# EAGLE design esp07_co2 (EAGLE 7.4.0)
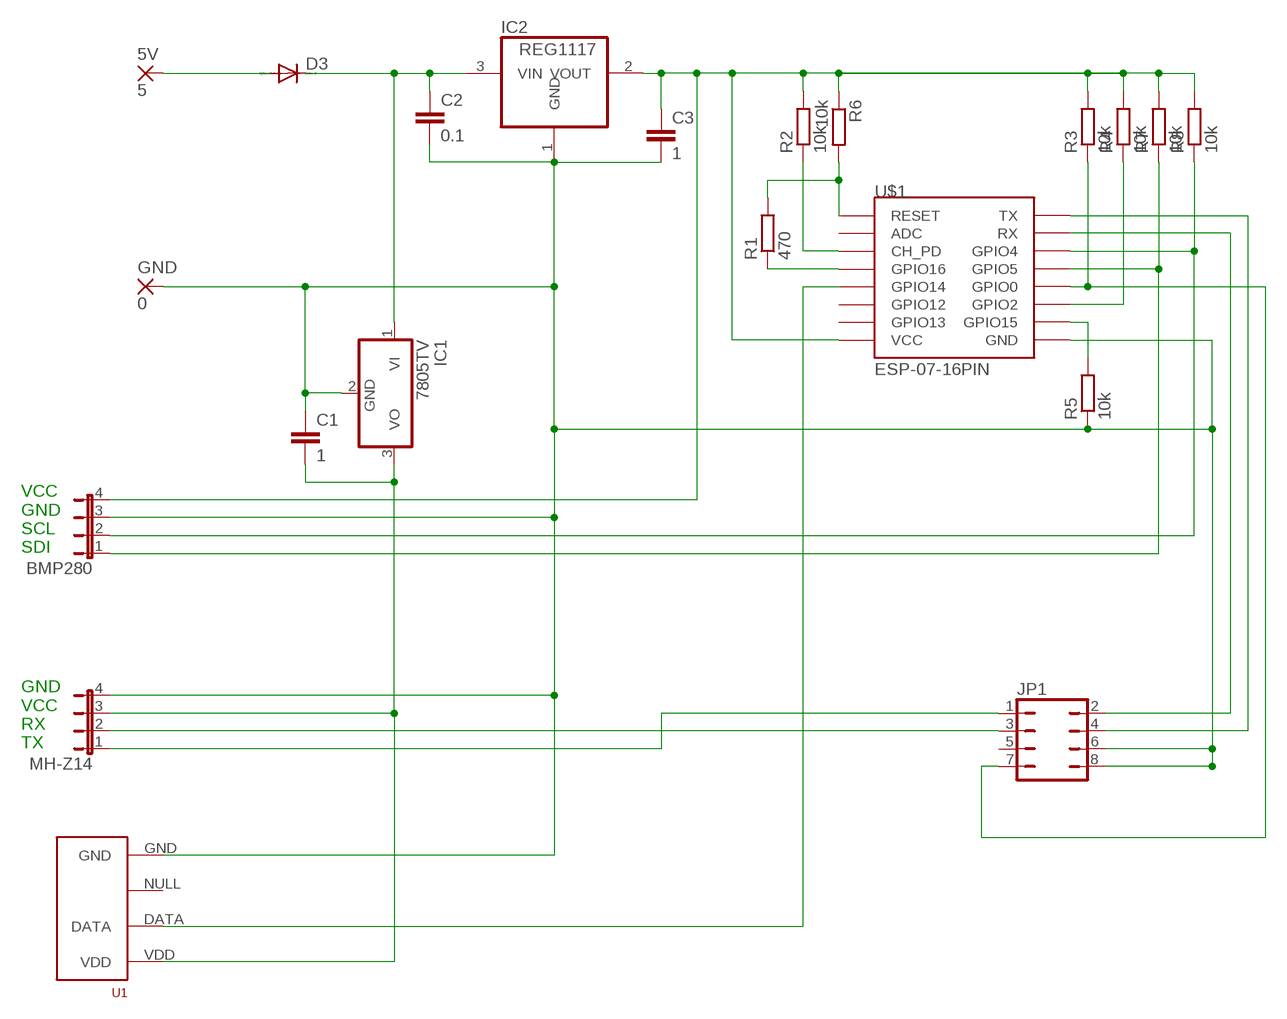
[diagram p0: schematic, sheet 1]

## Parts
5V  5  2,54/0,9  [2,54/0,9]
BMP280  JP4E  [JP4]
C1  1  C-EUC0805  [C0805]
C2  0.1  C-EUC0805  [C0805]
C3  1  C-EUC0805  [C0805]
D3  DIODE-SOD80C  [SOD80C]
GND  0  2,54/0,9  [2,54/0,9]
IC1  7805TV  [TO220V]
IC2  REG1117  [SOT223]
JP1  JP4Q  [JP4Q]
MH-Z14  JP4E  [JP4]
R1  470  R-EU_R1206  [R1206]
R2  10k  R-EU_R1206  [R1206]
R3  10k  R-EU_R1206  [R1206]
R4  10k  R-EU_R1206  [R1206]
R5  10k  R-EU_R1206  [R1206]
R6  10k  R-EU_R1206  [R1206]
R7  10k  R-EU_R1206  [R1206]
R8  10k  R-EU_R1206  [R1206]
U1  RHT03_DHT-22_AM2302RA  [RHT03_DHT-22/RA]
U$1  ESP-07-16PIN  [ESP-07-16PIN]

## Nets
N$1: 5V.1(P) D3.A
N$2: BMP280.2 R8.1 U$1.GPIO4
N$3: BMP280.4 C3.1 IC2.2(VOUT) R2.2 R3.2 R4.2 R6.1 R7.2 R8.2 U$1.VCC
N$4: BMP280.3 C1.1 C2.2 C3.2 GND.1(P) IC1.2(GND) IC2.1(GND) JP1.6 JP1.8 MH-Z14.4 R5.1 U1.GND U$1.GND
N$5: JP1.4 U$1.TX
N$6: JP1.2 U$1.RX
N$7: R1.1 U$1.GPIO16
N$8: R5.2 U$1.GPIO15
N$9: JP1.7 R3.1 U$1.GPIO0
N$10: R4.1 U$1.GPIO2
N$11: R2.1 U$1.CH_PD
N$12: R1.2 R6.2 U$1.REST(RESET)
N$14: JP1.3 MH-Z14.2
N$15: JP1.1 MH-Z14.1
N$16: U1.DATA U$1.GPIO14
N$17: BMP280.1 R7.1 U$1.GPIO5
N$20: C1.2 IC1.3(VO) MH-Z14.3 U1.VDD
N$25: C2.1 D3.C IC1.1(VI) IC2.3(VIN)
Unconnected: JP1.5 U1.NULL U$1.ADC U$1.GPIO12 U$1.GPIO13

## Notes on the sheet
- VCC
  GND
  SCL
  SDI
- GND
  VCC
  RX
  TX

## Library data of the parts
5V GND = wirepad:2,54/0,9: THROUGH-HOLE PAD
BMP280 MH-Z14 = jumper:JP4E: JUMPER
C1-C3 = rcl:C-EU: CAPACITOR, European symbol
D3 = diode:DIODE-: DIODE
IC1 = linear:78*: Positive VOLTAGE REGULATOR Source: http://cache.national.com/ds/LM/LM78L05.pdf http://www.fairchildsemi.com/ds/LM/LM7805.pdf
IC2 = burr-brown:REG1117: 800mA and 1A Low Dropout (LDO) Positive Regulator 1.8V, 2.5V, 2.85V, 3.3V, 5V, and Adj; MPN: REG1117; OC_FARNELL: 1097566; OC_NEWARK: 14P6981
JP1 = jumper:JP4Q: JUMPER
R1-R8 = resistor:R-EU_: RESISTOR, European symbol
U1 = RHT03_DHT-22_AM2302:RHT03_DHT-22_AM2302: RHT03 / DHT-22 / AM2302 Packages and symbol for the RHT03 / DHT-22 relative humidity and temperature sensor. Note: The AM2302 is a wired version of the DHT-22 which typically requires less clearance and is thus provided as a separate package.; PROD_ID: SEN-10167
U$1 = esp8266modules:ESP-07-16PIN: ESP8266 Wifi Module ESP-07 - 16 pins; DIMENSIONS: 22.0 x 16.0 mm; PINS: 16; PITCH: 0.078" / 2 mm

## Board
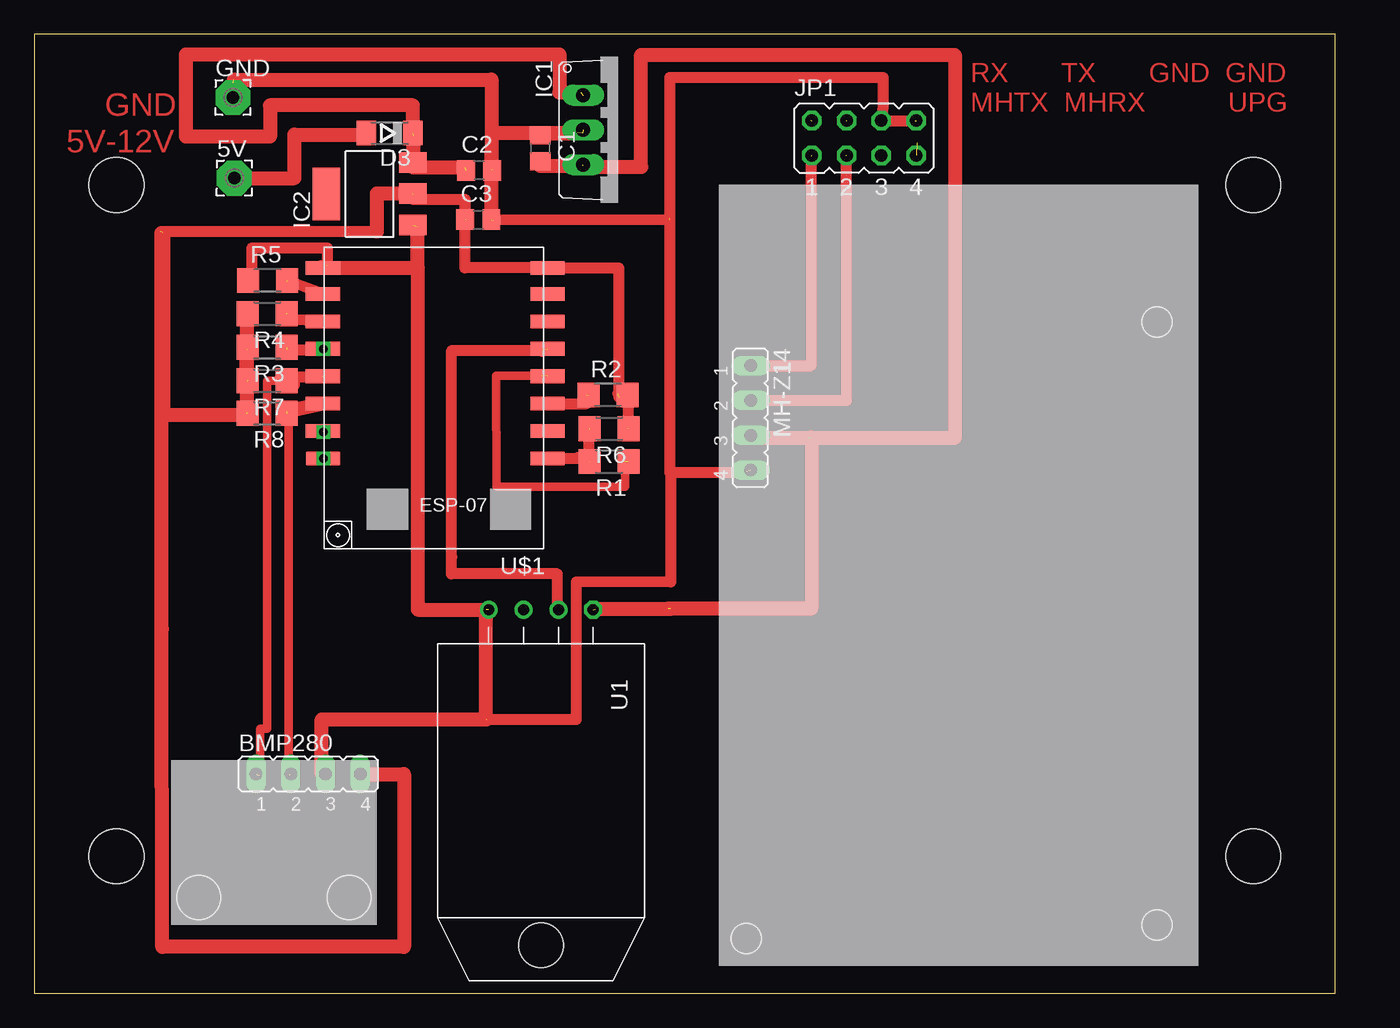
[diagram p1: board, top side]
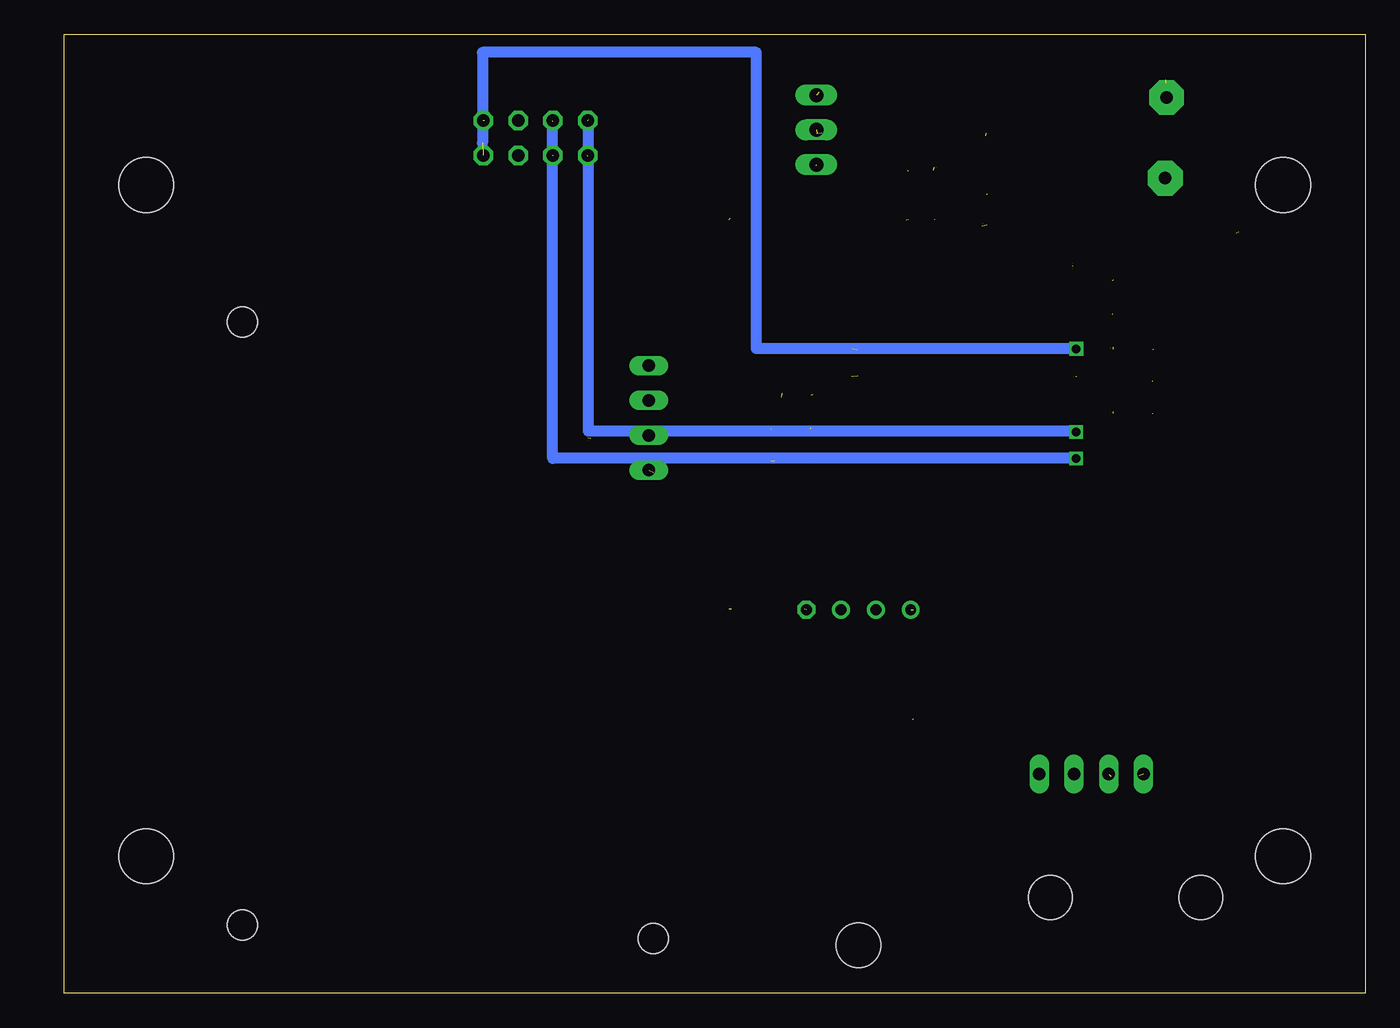
[diagram p2: board, bottom side, seen from below]

Size 95 x 70 mm. Coordinates in mm from the lower left corner, seen from the top.
Outline: 0,0 95,0 95,70 0,70 0,0
Copper layers (1*16): Top 0.035mm / dielectric 1.5mm / Bottom 0.035mm
Design rules "default": minimum track width 10mil, minimum drill 24mil, track to track 8mil, track to pad 8mil, pad to pad 8mil, via to via 8mil, smd to smd 8mil, copper to edge 40mil, drill to drill 8mil, minimum pad ring 10mil, minimum via ring 8mil, stop-mask expansion 4mil, vias tented up to drill 0mil, thermal gap 10mil
Holes 4 mm at 6,59 89,59 89,10 6,10
Holes 2.2 mm at 52,4 82,5 82,49
Holes 3.2 mm at 12,7 23,7

### Footprints (pad centres in the part's own frame; a part is rotated, then mirrored left to right if it is on the bottom)
2,54/0,9 = drill 0.914 pad 2.54 octagon: 1 0,0
JP4 = drill 0.914 long: 1 -3.81,0; 2 -1.27,0; 3 1.27,0; 4 3.81,0
C0805 = smd 1.3 x 1.5: 1 -0.95,0; 2 0.95,0
SOD80C = smd 1.4 x 1.8: A 1.7,0; C -1.7,0
TO220V = drill 1.016 long: 1 -2.54,-2.54; 2 0,-2.54; 3 2.54,-2.54
SOT223 = smd 1.499 x 2.007: 1 -2.261,-3.15; 2 0.025,-3.15; 3 2.311,-3.15 | smd 3.81 x 2.007: 4 0,3.15
JP4Q = drill 0.914 octagon: 1 -3.81,-1.27; 2 -3.81,1.27; 3 -1.27,-1.27; 4 -1.27,1.27; 5 1.27,-1.27; 6 1.27,1.27; 7 3.81,-1.27; 8 3.81,1.27
R1206 = smd 1.6 x 1.803: 1 -1.422,0; 2 1.422,0
RHT03_DHT-22/RA = drill 0.8: DATA -1.27,0; GND 3.81,0; NULL 1.27,0 | drill 0.8 octagon: VDD -3.81,0 | hole 3.25: 0,24.5
ESP-07-16PIN = smd 2.5 x 1: ADC -8.2,3.8; CH_PD -8.2,1.8; GND 8.2,-8.105; GPIO0 8.2,-2.2; GPIO2 8.2,-4.2; GPIO4 8.2,1.8; GPIO5 8.2,-0.2; GPIO12 -8.2,-4.2; GPIO13 -8.2,-6.2; GPIO14 -8.2,-2.2; GPIO15 8.2,-6.2; GPIO16 -8.2,-0.2; REST -8.2,5.8; RX 8.2,3.8; TX 8.2,5.8; VCC -8.2,-8.105

### Placement (x,y rotation side)
5V  14.6,59.5 0 top
BMP280  20,16 0 top
C1  36.95,61.69 270 top
C2  32.47,60.06 0 top
C3  32.42,56.46 0 top
D3  25.95,62.79 180 top
GND  14.51,65.38 0 top
IC1  42.62,63.02 270 top
IC2  24.48,58.34 90 top
JP1  60.59,62.42 0 top
MH-Z14  52.3,42 270 top
R1  41.96,38.82 180 top
R2  41.88,43.67 0 top
R3  17,47.16 180 top
R4  17.02,49.61 180 top
R5  17.04,52.03 0 top
R6  41.98,41.21 180 top
R7  17,44.7 180 top
R8  16.99,42.34 180 top
U1  37,28 180 top
U$1  29.28,44.84 180 top

### Tracks (layer width: path | path; a pad name or v marks a point on that pad's centre or on a via)
N$1
  Top 1.016: 5V.1 19,59.5 19,62.68 24.25,62.68 D3.A
N$2  (2 unrouted)
  Top 0.61: 18.59,42.32 18.59,15.84
  Top 0.813: 18.45,42.46 18.59,42.32
  Top 1.016: U$1.GPIO4 18.45,42.46
N$3  (9 unrouted)
  Top 0.813: R2.2 42.6,43.79 43.34,43.79 43.34,41.2 | 25,55.6 9.24,55.59 | 31.45,57.93 31.45,52.95 U$1.VCC 42.67,52.95 42.67,43.51 | 31.45,57.93 27.68,57.93 27.68,58.3 | 31.45,57.93 31.46,57.93 31.46,56.5
  Top 1.016: BMP280.4 27,16 27,3.39 9.34,3.39 9.32,26.58 9.29,55.51 9.42,55.51 9.42,42.23 15.52,42.23 15.52,42.34 | IC2.2 25,58.36 25,55.6 | R4.2 15.52,49.61 15.52,42.32 | 15.52,47.08 15.52,47 R3.2 | R7.2 15.55,44.63 15.55,44.54 15.49,44.54 15.49,44.57 | R8.2 15.55,42.34 15.55,44.66 15.53,44.66 15.53,46.99
N$4  (12 unrouted)
  Top 0.406: C3.2 33.35,56.47 33.35,59.94
  Top 0.813: 33.35,60.05 33.35,59.94 | R5.1 15.9,52.67 15.9,54.4 21.4,54.4 21.4,53.1 | 46.46,38.04 46.46,30.04 39.57,30.01 39.56,19.98 33.07,19.98 33.07,19.93 | 46.46,38.04 46.41,38.03 46.41,56.47 33.5,56.44 33.5,56.62 | 46.46,38.04 51.97,38.04 51.97,37.95 | 46.39,56.58 46.39,66.84 62,66.84 62,64.69 JP1.6 64.31,63.69 64.31,63.88 | U$1.GND 21.36,52.95 21.36,53.1
  Top 1.016: C3.2 33.38,66.69 14.57,66.69 | BMP280.3 21,16 21,20 33,20 33,28 28,28 28,52.95 | 28,52.95 U$1.GND 21,52.95 21,53 | 28,52.95 28,56 | GND.1 14.51,66.42 14.56,66.42 | C2.2 33.42,62.81 39.67,62.81 | C1.1 36.95,62.79 40.03,62.79
N$5  (2 unrouted)
  Bottom 0.813: U$1.TX 59.33,39.04 59.33,63.67
N$6  (2 unrouted)
  Bottom 0.813: U$1.RX 56.72,41.04 56.72,63.74
N$7  (2 unrouted)
  Top 0.61: 37.05,45.02 37.05,45.07 33.71,45.07 33.76,36.97 43.13,36.97 43.13,38.84
N$8  (1 unrouted)
  Top 0.813: U$1.GPIO15 18.38,52.04
N$9  (via drill 0.6)  (3 unrouted)
  Top 0.61: 20.96,46.92 v21.09,47.05 21.13,47.05
  Top 0.813: 20.96,46.92 18.42,46.92 18.42,47.03
  Bottom 0.813: v21.09,47.05 44.46,47.05 44.46,68.67 64.45,68.67 64.45,62.06
N$10  (1 unrouted)
  Top 0.813: U$1.GPIO2 18.44,49.2 18.46,49.2 18.46,49.58
N$11  (1 unrouted)
  Top 0.813: U$1.CH_PD 40.33,43.04 40.33,43.7
N$12  (2 unrouted)
  Top 0.61: 39.74,39.04 40.55,39.04 40.55,38.84
  Top 0.813: 39.74,39.04 U$1.REST 39.7,39.04 39.7,39.11 | R1.2 40.5,38.82 40.5,41.25
N$14  (1 unrouted)
  Top 0.813: MH-Z14.2 59.31,43.27 JP1.3
N$15  (1 unrouted)
  Top 0.813: MH-Z14.1 56.73,45.81 56.73,61.1
N$16  (1 unrouted)
  Top 0.813: U1.DATA 38.21,28 38.21,30.61 30.47,30.61 30.47,31.83 30.48,31.83 30.48,46.93 37.09,46.93 37.09,46.86
N$17  (2 unrouted)
  Top 0.61: R7.1 17.01,44.71 17,19.31 16.48,19.31 16.48,15.86
  Top 0.813: R7.1 19,44.41 19,45 21.09,45.01
N$18  (via drill 0.6)
  other vias: 64.4,61.09
N$19  (via drill 0.6)
  other vias: 59.31,63.67
N$20  (4 unrouted)
  Top 0.813: MH-Z14.3 52.4,40.73 52.4,40.8
  Top 1.016: 41.1,28.04 40.95,28.04 40.95,28.06 46.45,28.06 | MH-Z14.3 52.3,40.56 56.74,40.56 56.74,28.07 46.27,28.07 | C1.2 36.95,60.4 40.08,60.4 40.08,60.31 44.31,60.31 44.31,68.49 67.21,68.49 67.21,40.53 56.58,40.53
N$21  (via drill 0.6)
  other vias: 56.8,63.64
N$22  (via drill 0.6)
  other vias: 21.11,39.04
N$23  (via drill 0.6)
  other vias: 21.11,40.97
N$24  (via drill 0.6)
  other vias: 21.11,47.03
N$25  (3 unrouted)
  Top 1.016: IC2.3 27.69,60.65 | 27.69,60.65 27.69,62.58 | D3.C 27.65,64.81 17.22,64.81 17.22,62.52 11.09,62.52 11.09,68.53 38.35,68.53 38.35,65.74 39.9,65.76 | 27.69,60.65 27.69,60.29 31.47,60.29

### Text on the board
Top: GND | RX TX GND GND / MHTX MHRX UPG | 5V-12V